# Altium schematic sheet USB.SchDoc: Наименование
size 420 x 297 mm; ApprovedBy: Сидоров; CheckedBy: Петров; Author: Иванов; CompanyName: РГППУ; Title2str: Изделия; DecimalNumber: АБВГ.123456.001 33
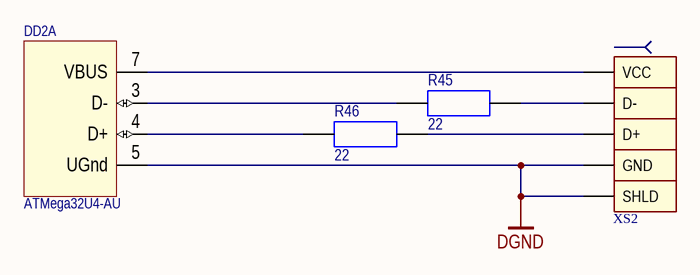
[diagram p0: USB.SchDoc]

## Parts
DD2  ATMega32U4-AU  [44ML_L]  (part A of 3)
R45  22  [SMDRC0805]
R46  22  [SMDRC0805]
XS2  USB B A-09 РОЗЕТКА НА ПЛАТУ  [USB2.0B_Vertical]  (value not drawn)

## Nets
DGND: DD2.5(UGnd) XS2.GND XS2.SHLD
NetDD2_3: DD2.3(D-) R45.1
NetDD2_4: DD2.4(D+) R46.1
NetDD2_7: DD2.7(VBUS) XS2.VCC
NetR45_2: R45.2 XS2.D-
NetR46_2: R46.2 XS2.D+

## Notes on the sheet
- Изм.
- Лист
- N*докум.
- Подп.
- Дата
- Лит.
- Масса
- Масштаб
- Разраб.
- Пров.
- Т.контр.
- Лиcт
- Лиcтов
- Н.контр.
- Утв.

## Library data of the parts
DD2 = ATMega32U4: ManufacturerPartNumber: ATMega32U4-AU
R45 R46 = Resistor 0805 22: Generic resistor; PartNumber: Resistor 0805 22; Value: 22; ComponentLink1URL: http://www.mouser.com/ds/2/447/PYu-RC0402_51_RoHS_L_6_r-8721.pdf; ComponentLink1Description: Datasheet; Package: 0805
XS2 = USB2.0-BR: USB-B Vertical; ManufacturerPartNumber: USB B A-09 РОЗЕТКА НА ПЛАТУ; ComponentLink1Description: Datasheet; ComponentLink1URL: http://www.promelec.ru/catalog/406/1229/1281/1/124861/; ComponentLink2Description: Datasheet-local; ComponentLink2URL: *